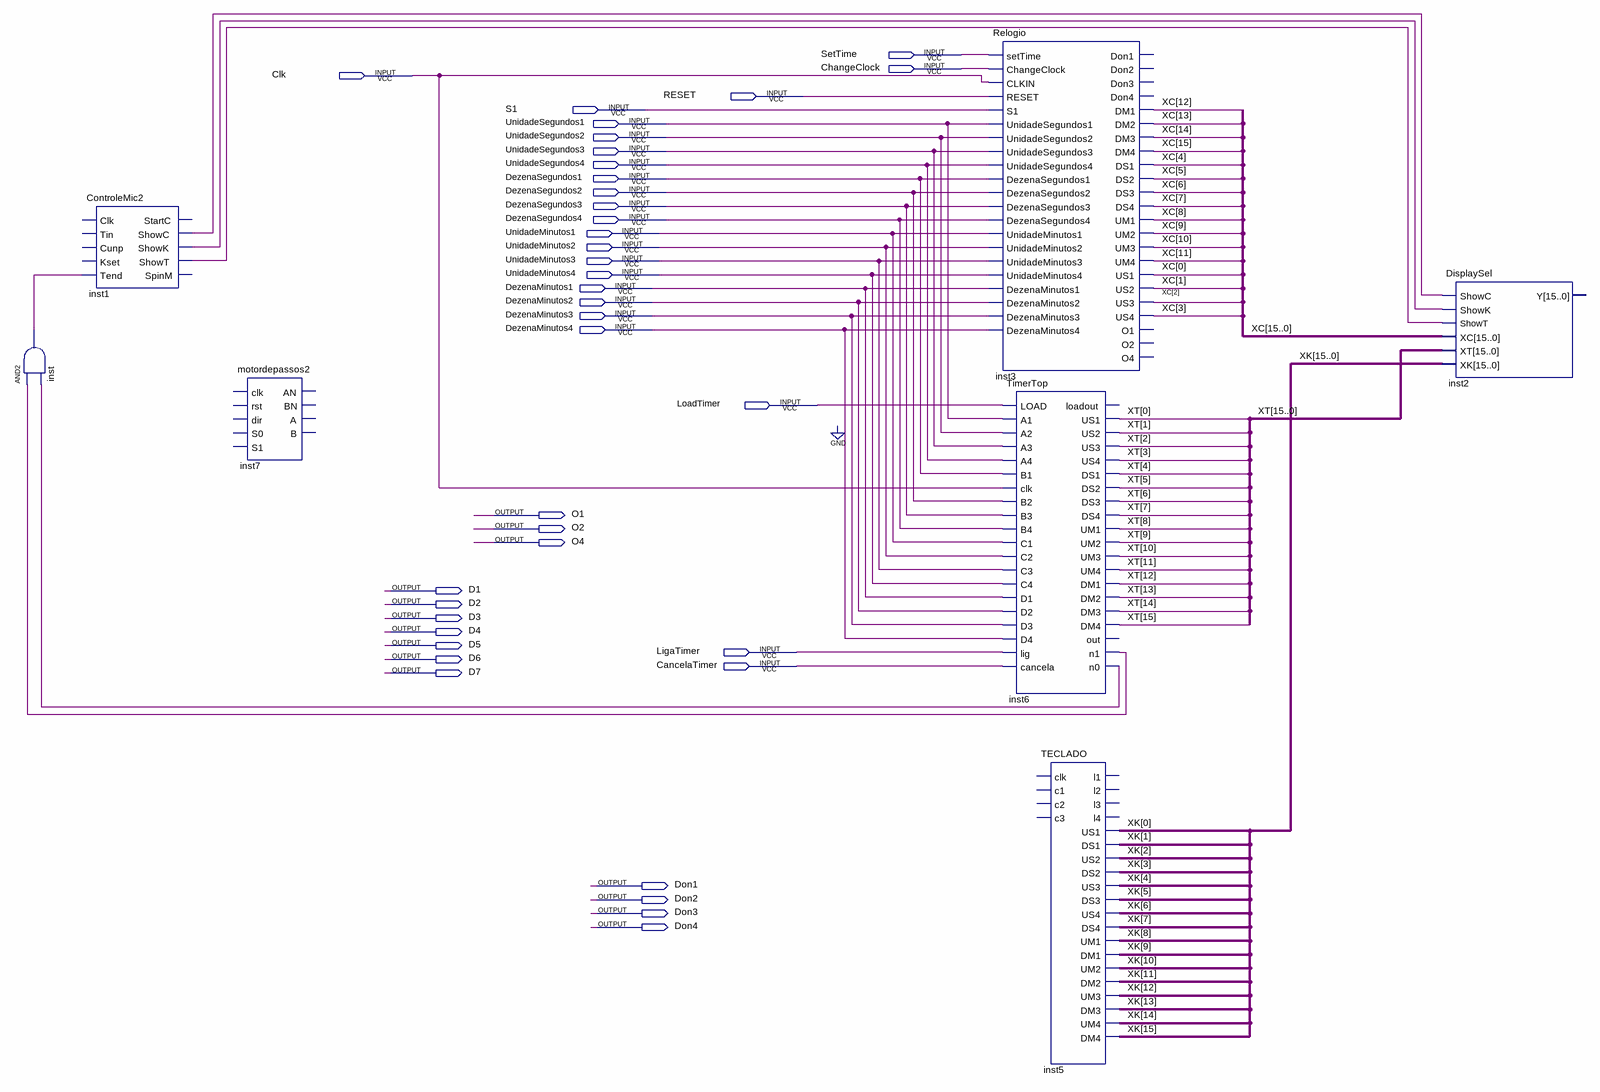
[diagram p0: schematic sheet]
// Quartus schematic Microondas.bdf as structural Verilog: 7 symbols, 38 pins
module Microondas (
  input  SetTime,
  input  ChangeClock,
  input  Clk,
  input  RESET,
  input  S1,
  input  UnidadeSegundos1,
  input  UnidadeSegundos2,
  input  UnidadeSegundos3,
  input  UnidadeSegundos4,
  input  DezenaSegundos1,
  input  DezenaSegundos2,
  input  DezenaSegundos3,
  input  DezenaSegundos4,
  input  UnidadeMinutos1,
  input  UnidadeMinutos2,
  input  UnidadeMinutos3,
  input  UnidadeMinutos4,
  input  DezenaMinutos1,
  input  DezenaMinutos2,
  input  DezenaMinutos3,
  input  DezenaMinutos4,
  input  LoadTimer,
  input  LigaTimer,
  input  CancelaTimer,
  output O1,
  output O2,
  output O4,
  output D1,
  output D2,
  output D3,
  output D4,
  output D5,
  output D6,
  output D7,
  output Don1,
  output Don2,
  output Don3,
  output Don4
);

  wire inst1_showc, inst1_showk, inst1_showt, inst6_n0, inst6_n1, inst_out;
  wire [15:0] XC, XK, XT;

  and inst (inst_out, inst6_n1, inst6_n0);
  ControleMic2 inst1 (
    .Tend(inst_out), .ShowC(inst1_showc), .ShowK(inst1_showk), .ShowT(inst1_showt));  // open: Clk, Tin, Cunp, Kset, StartC, SpinM
  motordepassos2 inst7 ();  // open: clk, rst, dir, S0, S1, AN, BN, A, B
  Relogio inst3 (
    .setTime(SetTime), .ChangeClock(ChangeClock), .CLKIN(Clk), .RESET(RESET), .S1(S1),
    .UnidadeSegundos1(UnidadeSegundos1), .UnidadeSegundos2(UnidadeSegundos2),
    .UnidadeSegundos3(UnidadeSegundos3), .UnidadeSegundos4(UnidadeSegundos4),
    .DezenaSegundos1(DezenaSegundos1), .DezenaSegundos2(DezenaSegundos2), .DezenaSegundos3(DezenaSegundos3),
    .DezenaSegundos4(DezenaSegundos4), .UnidadeMinutos1(UnidadeMinutos1), .UnidadeMinutos2(UnidadeMinutos2),
    .UnidadeMinutos3(UnidadeMinutos3), .UnidadeMinutos4(UnidadeMinutos4), .DezenaMinutos1(DezenaMinutos1),
    .DezenaMinutos2(DezenaMinutos2), .DezenaMinutos3(DezenaMinutos3), .DezenaMinutos4(DezenaMinutos4),
    .DM1(XC[12]), .DM2(XC[13]), .DM3(XC[14]), .DM4(XC[15]), .DS1(XC[4]), .DS2(XC[5]), .DS3(XC[6]),
    .DS4(XC[7]), .UM1(XC[8]), .UM2(XC[9]), .UM3(XC[10]), .UM4(XC[11]), .US1(XC[0]), .US2(XC[1]), .US3(XC[2]),
    .US4(XC[3]));  // open: Don1, Don2, Don3, Don4, O1, O2, O4
  TimerTop inst6 (
    .LOAD(LoadTimer), .A1(UnidadeSegundos1), .A2(UnidadeSegundos2), .A3(UnidadeSegundos3),
    .A4(UnidadeSegundos4), .B1(DezenaSegundos1), .clk(Clk), .B2(DezenaSegundos2), .B3(DezenaSegundos3),
    .B4(DezenaSegundos4), .C1(UnidadeMinutos1), .C2(UnidadeMinutos2), .C3(UnidadeMinutos3),
    .C4(UnidadeMinutos4), .D1(DezenaMinutos1), .D2(DezenaMinutos2), .D3(DezenaMinutos3), .D4(DezenaMinutos4),
    .lig(LigaTimer), .cancela(CancelaTimer), .US1(XT[0]), .US2(XT[1]), .US3(XT[2]), .US4(XT[3]), .DS1(XT[4]),
    .DS2(XT[5]), .DS3(XT[6]), .DS4(XT[7]), .UM1(XT[8]), .UM2(XT[9]), .UM3(XT[10]), .UM4(XT[11]),
    .DM1(XT[12]), .DM2(XT[13]), .DM3(XT[14]), .DM4(XT[15]), .n1(inst6_n1), .n0(inst6_n0));  // open: loadout, out
  TECLADO inst5 (
    .US1(XK[0]), .DS1(XK[1]), .US2(XK[2]), .DS2(XK[3]), .US3(XK[4]), .DS3(XK[5]), .US4(XK[6]), .DS4(XK[7]),
    .UM1(XK[8]), .DM1(XK[9]), .UM2(XK[10]), .DM2(XK[11]), .UM3(XK[12]), .DM3(XK[13]), .UM4(XK[14]),
    .DM4(XK[15]));  // open: clk, c1, c2, c3, l1, l2, l3, l4
  DisplaySel inst2 (
    .ShowC(inst1_showc), .ShowK(inst1_showk), .ShowT(inst1_showt), .XC(XC), .XT(XT), .XK(XK));  // open: Y
endmodule
